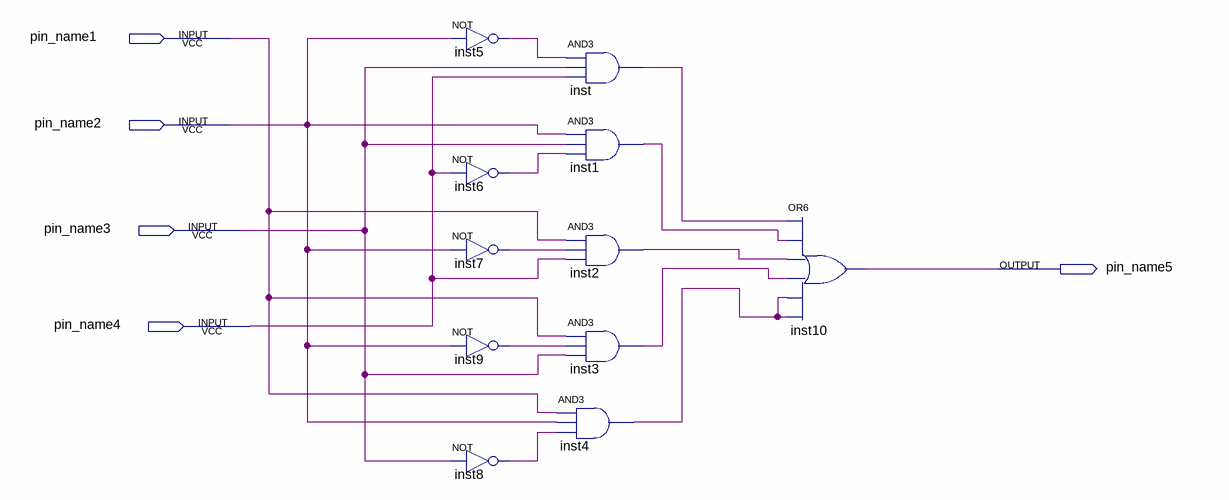
[diagram p0: schematic sheet]
// Quartus schematic C4.bdf as structural Verilog: 11 symbols, 5 pins
module C4 (
  input  pin_name1,
  input  pin_name2,
  input  pin_name3,
  input  pin_name4,
  output pin_name5
);

  wire inst1_out, inst2_out, inst3_out, inst4_out, inst5_out, inst6_out, inst7_out, inst8_out, inst9_out,
       inst_out;

  not inst5 (inst5_out, pin_name2);
  not inst6 (inst6_out, pin_name4);
  not inst7 (inst7_out, pin_name2);
  not inst9 (inst9_out, pin_name2);
  not inst8 (inst8_out, pin_name3);
  and inst (inst_out, inst5_out, pin_name3, pin_name4);
  and inst1 (inst1_out, pin_name2, pin_name3, inst6_out);
  and inst2 (inst2_out, pin_name1, inst7_out, pin_name4);
  and inst3 (inst3_out, pin_name1, inst9_out, pin_name3);
  and inst4 (inst4_out, pin_name1, pin_name2, inst8_out);
  or inst10 (pin_name5, inst_out, inst1_out, inst2_out, inst3_out, inst4_out, inst4_out);
endmodule
